# Altium schematic sheet processor_main_connector.SchDoc: processor_main_connector.schdoc
size A4; DrawnBy: Ryan Castle; Engineer: Ryan Castle; Organization: Badgerloop; Address1: 133 Engineering Research; Address2: Building; Address3: Madison, WI 53715; DocumentNumber: 1; Revision: A; SheetNumber: X; SheetTotal: Y
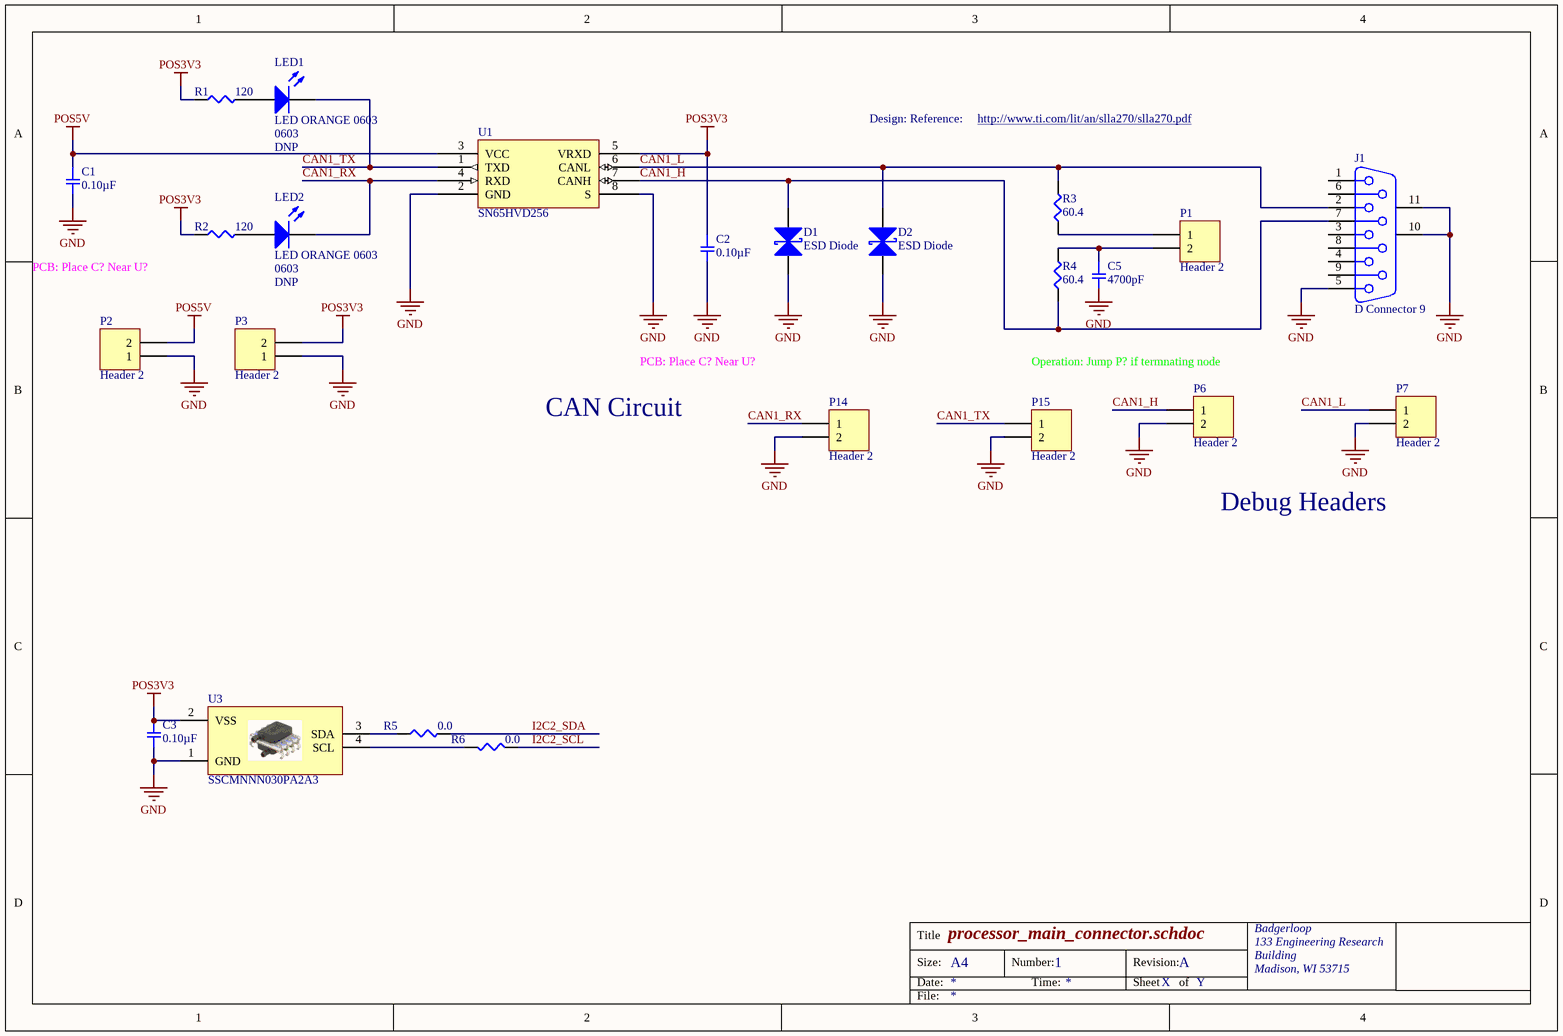
[diagram p0: processor_main_connector.SchDoc]

## Parts
C1  0.10µF  [SMD-0805C]
C2  0.10µF  [SMD-0805C]
C3  0.10µF  [SMD-0805C]
C5  4700pF  [SMD-0805C]
D1  ESD Diode  [SMD-0402-RES]
D2  ESD Diode  [SMD-0402-RES]
J1  D Connector 9  [DSUB1.385-2H9]
LED1  LED ORANGE 0603  Package / Case: 0603  [LED 0603 ORANGE]
LED2  LED ORANGE 0603  Package / Case: 0603  [LED 0603 ORANGE]
P1  Header 2  [Pin Header 1x2 TH Pitch 2.54mm]
P2  Header 2  [Pin Header 1x2 TH Pitch 2.54mm]
P3  Header 2  [Pin Header 1x2 TH Pitch 2.54mm]
P6  Header 2  [Pin Header 1x2 TH Pitch 2.54mm]
P7  Header 2  [Pin Header 1x2 TH Pitch 2.54mm]
P14  Header 2  [Pin Header 1x2 TH Pitch 2.54mm]
P15  Header 2  [Pin Header 1x2 TH Pitch 2.54mm]
R1  120  [SMD-0402-RES]
R2  120  [SMD-0402-RES]
R3  60.4  [SMD-0402-RES]
R4  60.4  [SMD-0402-RES]
R5  0.0  [SMD-0402-RES]
R6  0.0  [SMD-0402-RES]
U1  SN65HVD256  [SOIC127P630X175-8N]
U3  SSCMNNN030PA2A3  [8-SMT]

## Nets
GND: C1.2 C2.2 C3.2 C5.2 D1.1(A) D2.1(A) J1.5 J1.10(MH1) J1.11(MH2) P2.1 P3.1 P6.2 P7.2 P14.2 P15.2 U1.2(GND) U1.8(S) U3.1(GND)
POS3V3: C2.1 C3.1 P3.2 R1.1 R2.1 U1.5(VRXD) U3.2(VSS)
POS5V: C1.1 P2.2 U1.3(VCC)
CAN1_H: D1.2(K) J1.7 P6.1 R4.1 U1.7(CANH)
CAN1_L: D2.2(K) J1.2 P7.1 R3.2 U1.6(CANL)
CAN1_RX: LED2.2(K) P14.1 U1.4(RXD)
CAN1_TX: LED1.2(K) P15.1 U1.1(TXD)
I2C2_SCL: R6.1
I2C2_SDA: R5.2
NetC5_1: C5.1 P1.2 R4.2
NetLED1_1: LED1.1(A) R1.2
NetLED2_1: LED2.1(A) R2.2
NetP1_1: P1.1 R3.1
NetR5_1: R5.1 U3.3(SDA)
NetR6_2: R6.2 U3.4(SCL)

Not connected (* = marked no-connect by the designer): J1 1 3 4 6 8 9

## Notes on the sheet
- Design: Reference:
- http://www.ti.com/lit/an/slla270/slla270.pdf
- PCB: Place C? Near U?
- Operation: Jump P? if termnating node
- CAN Circuit
- Debug Headers
- Title
- Size:
- Date:
- A4
- Number:
- Time:
- Revision:
- Sheet
- of
- File:

## Library data of the parts
C1-C3 = GCD21BR71H104KA01L: CAP CER 0.1UF 50V X7R 0805; Manufacturer: Murata Electronics North America; Factory Stock: 0; Unit Price (USD): 0.24; Minimum Quantity: 1; Tolerance: ±10%; Datasheets: http://www.murata.com/~/media/webrenewal/support/library/catalog/products/capacitor/mlcc/c03e.ashx; Image: //media.digikey.com/Renders/Murata%20Renders/0805%28GxM6%29.jpg; Digi-Key Part Number: 490-11955-1-ND; Part Number: GCD21BR71H104KA01L; Quantity Available: 157; @ qty: 0; Packaging: Cut Tape (CT); Series: GCD; Part Status: Active; Value: 0.10µF; Voltage: 50V; Temperature Coefficient: X7R; Operating Temperature: -55°C ~ 125°C; Features: -; Ratings: AEC-Q200; Applications: Automotive; Mounting Type: Surface Mount, MLCC; Package / Case: 0805 (2012 Metric); Size / Dimension: 0.079" L x 0.049" W (2.00mm x 1.25mm); Height - Seated (Max): -; Thickness (Max): 0.049" (1.25mm); Lead Spacing: -; Lead Style: -
C5 = GCM2165C1H472JA16D: CAP CER 4700PF 50V NP0 0805; Manufacturer: Murata Electronics North America; Factory Stock: 0; Unit Price (USD): 0.26; Minimum Quantity: 1; Tolerance: ±5%; Temperature Coefficient: C0G, NP0; Datasheets: http://www.murata.com/~/media/webrenewal/support/library/catalog/products/capacitor/mlcc/c03e.ashx; Image: //media.digikey.com/Renders/Murata%20Renders/0805%28GxM6%29.jpg; Digi-Key Part Number: 490-4973-1-ND; Part Number: GCM2165C1H472JA16D; Quantity Available: 6989; @ qty: 0; Packaging: Cut Tape (CT); Series: GCM; Part Status: Active; Value: 4700pF; Voltage: 50V; Operating Temperature: -55°C ~ 125°C; Features: -; Ratings: AEC-Q200; Applications: Automotive; Mounting Type: Surface Mount, MLCC; Package / Case: 0805 (2012 Metric); Size / Dimension: 0.079" L x 0.049" W (2.00mm x 1.25mm); Height - Seated (Max): -; Thickness (Max): 0.028" (0.70mm); Lead Spacing: -; Lead Style: -
D1 D2 = ESD Diode: ESD Supressor; Manufacturer P/N: Panasonic; Manufacturer: EZAEG; Digikey P/N: P13571CT-ND; Digikey Link: https://www.digikey.com/product-detail/en/panasonic-electronic-components/EZA-EG2A50AX/P13571CT-ND/1137239
J1 = D Connector 9: Receptacle Assembly, 9 Position, Right Angle; PackageDocument: O; Positions: 9; Published: 15-Jun-2001; LatestRevisionDate: 17-Jul-2002; LatestRevisionNote: Re-released for DXP Platform.; DatasheetDocument: 1-Sep-1999; PackageReference: 788750; Publisher: Altium Limited; Orientation: Right Angle; Gender: Receptacle
LED1 LED2 = LED ORANGE 0603: A-0603UOC; Manufacturer: Lighthouse LEDs; Minimum Quantity: 1; Manufacturer P/N: A-0603UOC; Color: ORANGE; ComponentLink1Description: Manufacturer; ComponentLink1URL: https://lighthouseleds.com/0603-smd-led-orange-ultra-bright-170-mcd.html; Datasheets: https://lighthouseleds.com/downloads/dl/file/id/11/0603_orange_amber_smd_led_datasheet.pdf; Availability: In Stock; DNP: DNP
P1-P3 P6 P7 P14 P15 = Header 2: Header, 2-Pin; LatestRevisionDate: 17-Jul-2002; LatestRevisionNote: Re-released for DXP Platform.; Publisher: Altium Limited
R1 R2 = ERJ-2GEJ121X: RES SMD 120 OHM 5% 1/10W 0402; Manufacturer: Panasonic Electronic Components; Factory Stock: 0; Unit Price (USD): 0.00350; @ qty: 1500; Minimum Quantity: 1; Power (Watts): 0.1W, 1/10W; Temperature Coefficient: ±200ppm/°C; Part Number: ERJ-2GEJ121X; Datasheets: http://industrial.panasonic.com/www-cgi/jvcr13pz.cgi?E+PZ+3+AOA0001+ERJ2GEJ121X+7+WW; Image: //media.digikey.com/Photos/Panasonic%20Photos/ERJ-PA2-Series.jpg; Digi-Key Part Number: P120JCT-ND; Quantity Available: 172958; Packaging: Cut Tape (CT); Series: ERJ; Part Status: Active; Value: 120; Tolerance: ±5%; Composition: Thick Film; Features: Automotive AEC-Q200; Operating Temperature: -55°C ~ 155°C; Package / Case: 0402 (1005 Metric); Supplier Device Package: 0402; Size / Dimension: 0.039" L x 0.020" W (1.00mm x 0.50mm); Height - Seated (Max): 0.016" (0.40mm); Number of Terminations: 2; Failure Rate: -
R3 R4 = ERJ-2RKF60R4X: RES SMD 60.4 OHM 1% 1/10W 0402; Manufacturer: Panasonic Electronic Components; Factory Stock: 0; Unit Price (USD): 0.00496; @ qty: 1500; Minimum Quantity: 1; Power (Watts): 0.1W, 1/10W; Temperature Coefficient: ±100ppm/°C; Part Number: ERJ-2RKF60R4X; Datasheets: http://industrial.panasonic.com/www-cgi/jvcr13pz.cgi?E+PZ+3+AOA0002+ERJ2RKF60R4X+7+WW; Image: //media.digikey.com/Photos/Panasonic%20Photos/ERJ-PA2-Series.jpg; Digi-Key Part Number: P60.4LCT-ND; Quantity Available: 115835; Packaging: Cut Tape (CT); Series: ERJ; Part Status: Active; Value: 60.4; Tolerance: ±1%; Composition: Thick Film; Features: Automotive AEC-Q200; Operating Temperature: -55°C ~ 155°C; Package / Case: 0402 (1005 Metric); Supplier Device Package: 0402; Size / Dimension: 0.039" L x 0.020" W (1.00mm x 0.50mm); Height - Seated (Max): 0.016" (0.40mm); Number of Terminations: 2; Failure Rate: -
R5 R6 = ERJ-2GE0R00X: RES SMD 0.0OHM JUMPER 1/10W 0402; Manufacturer: Panasonic Electronic Components; Factory Stock: 0; Unit Price (USD): 0.00384; @ qty: 1500; Minimum Quantity: 1; Power (Watts): 0.1W, 1/10W; Part Number: ERJ-2GE0R00X; Datasheets: http://industrial.panasonic.com/www-cgi/jvcr13pz.cgi?E+PZ+3+AOA0001+ERJ2GE0R00X+7+WW; Image: //media.digikey.com/Photos/Panasonic%20Photos/ERJ-PA2-Series.jpg; Digi-Key Part Number: P0.0JCT-ND; Quantity Available: 3152483; Packaging: Cut Tape (CT); Series: ERJ; Part Status: Active; Value: 0.0; Tolerance: Jumper; Composition: Thick Film; Features: Automotive AEC-Q200; Temperature Coefficient: -; Operating Temperature: -55°C ~ 155°C; Package / Case: 0402 (1005 Metric); Supplier Device Package: 0402; Size / Dimension: 0.039" L x 0.020" W (1.00mm x 0.50mm); Height - Seated (Max): 0.016" (0.40mm); Number of Terminations: 2; Failure Rate: -
U1 = SN65HVD256: IC TXRX CAN 5V HS 8SOIC; Manufacturer: TI; Manufacturer P/N: SN65HVD256DR; Digikey P/N: 296-30093-1-ND; Digikey Link: https://www.digikey.com/product-detail/en/texas-instruments/SN65HVD256DR/296-30093-1-ND/2798832
U3 = SSCMNNN030PA2A3: Honeywell Digital Pressure Sensor; ComponentLink1Description: Part; ComponentLink1URL: https://www.digikey.com/product-detail/en/honeywell-sensing-and-productivity-solutions/SSCMNNN030PA2A3/480-6407-ND/2416123; ComponentLink2Description: Datasheet; ComponentLink2URL: https://sensing.honeywell.com/index.php?ci_id=151134